# EAGLE schematic SWD (EAGLE 7.4.0)
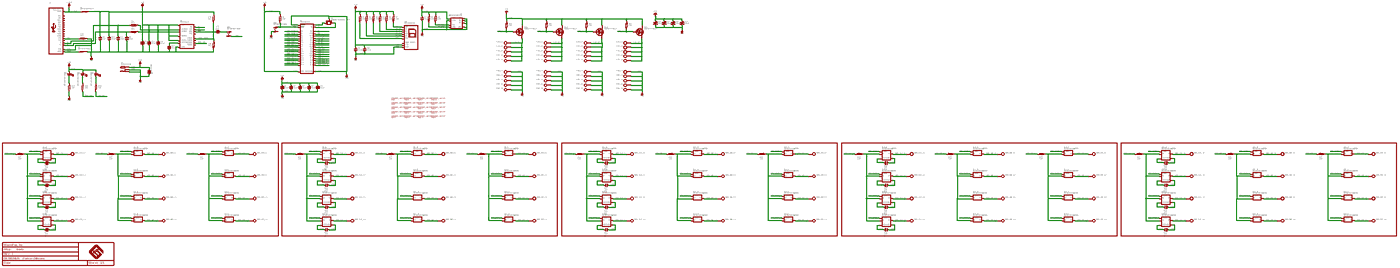
[diagram p0: schematic, sheet 1, overview]
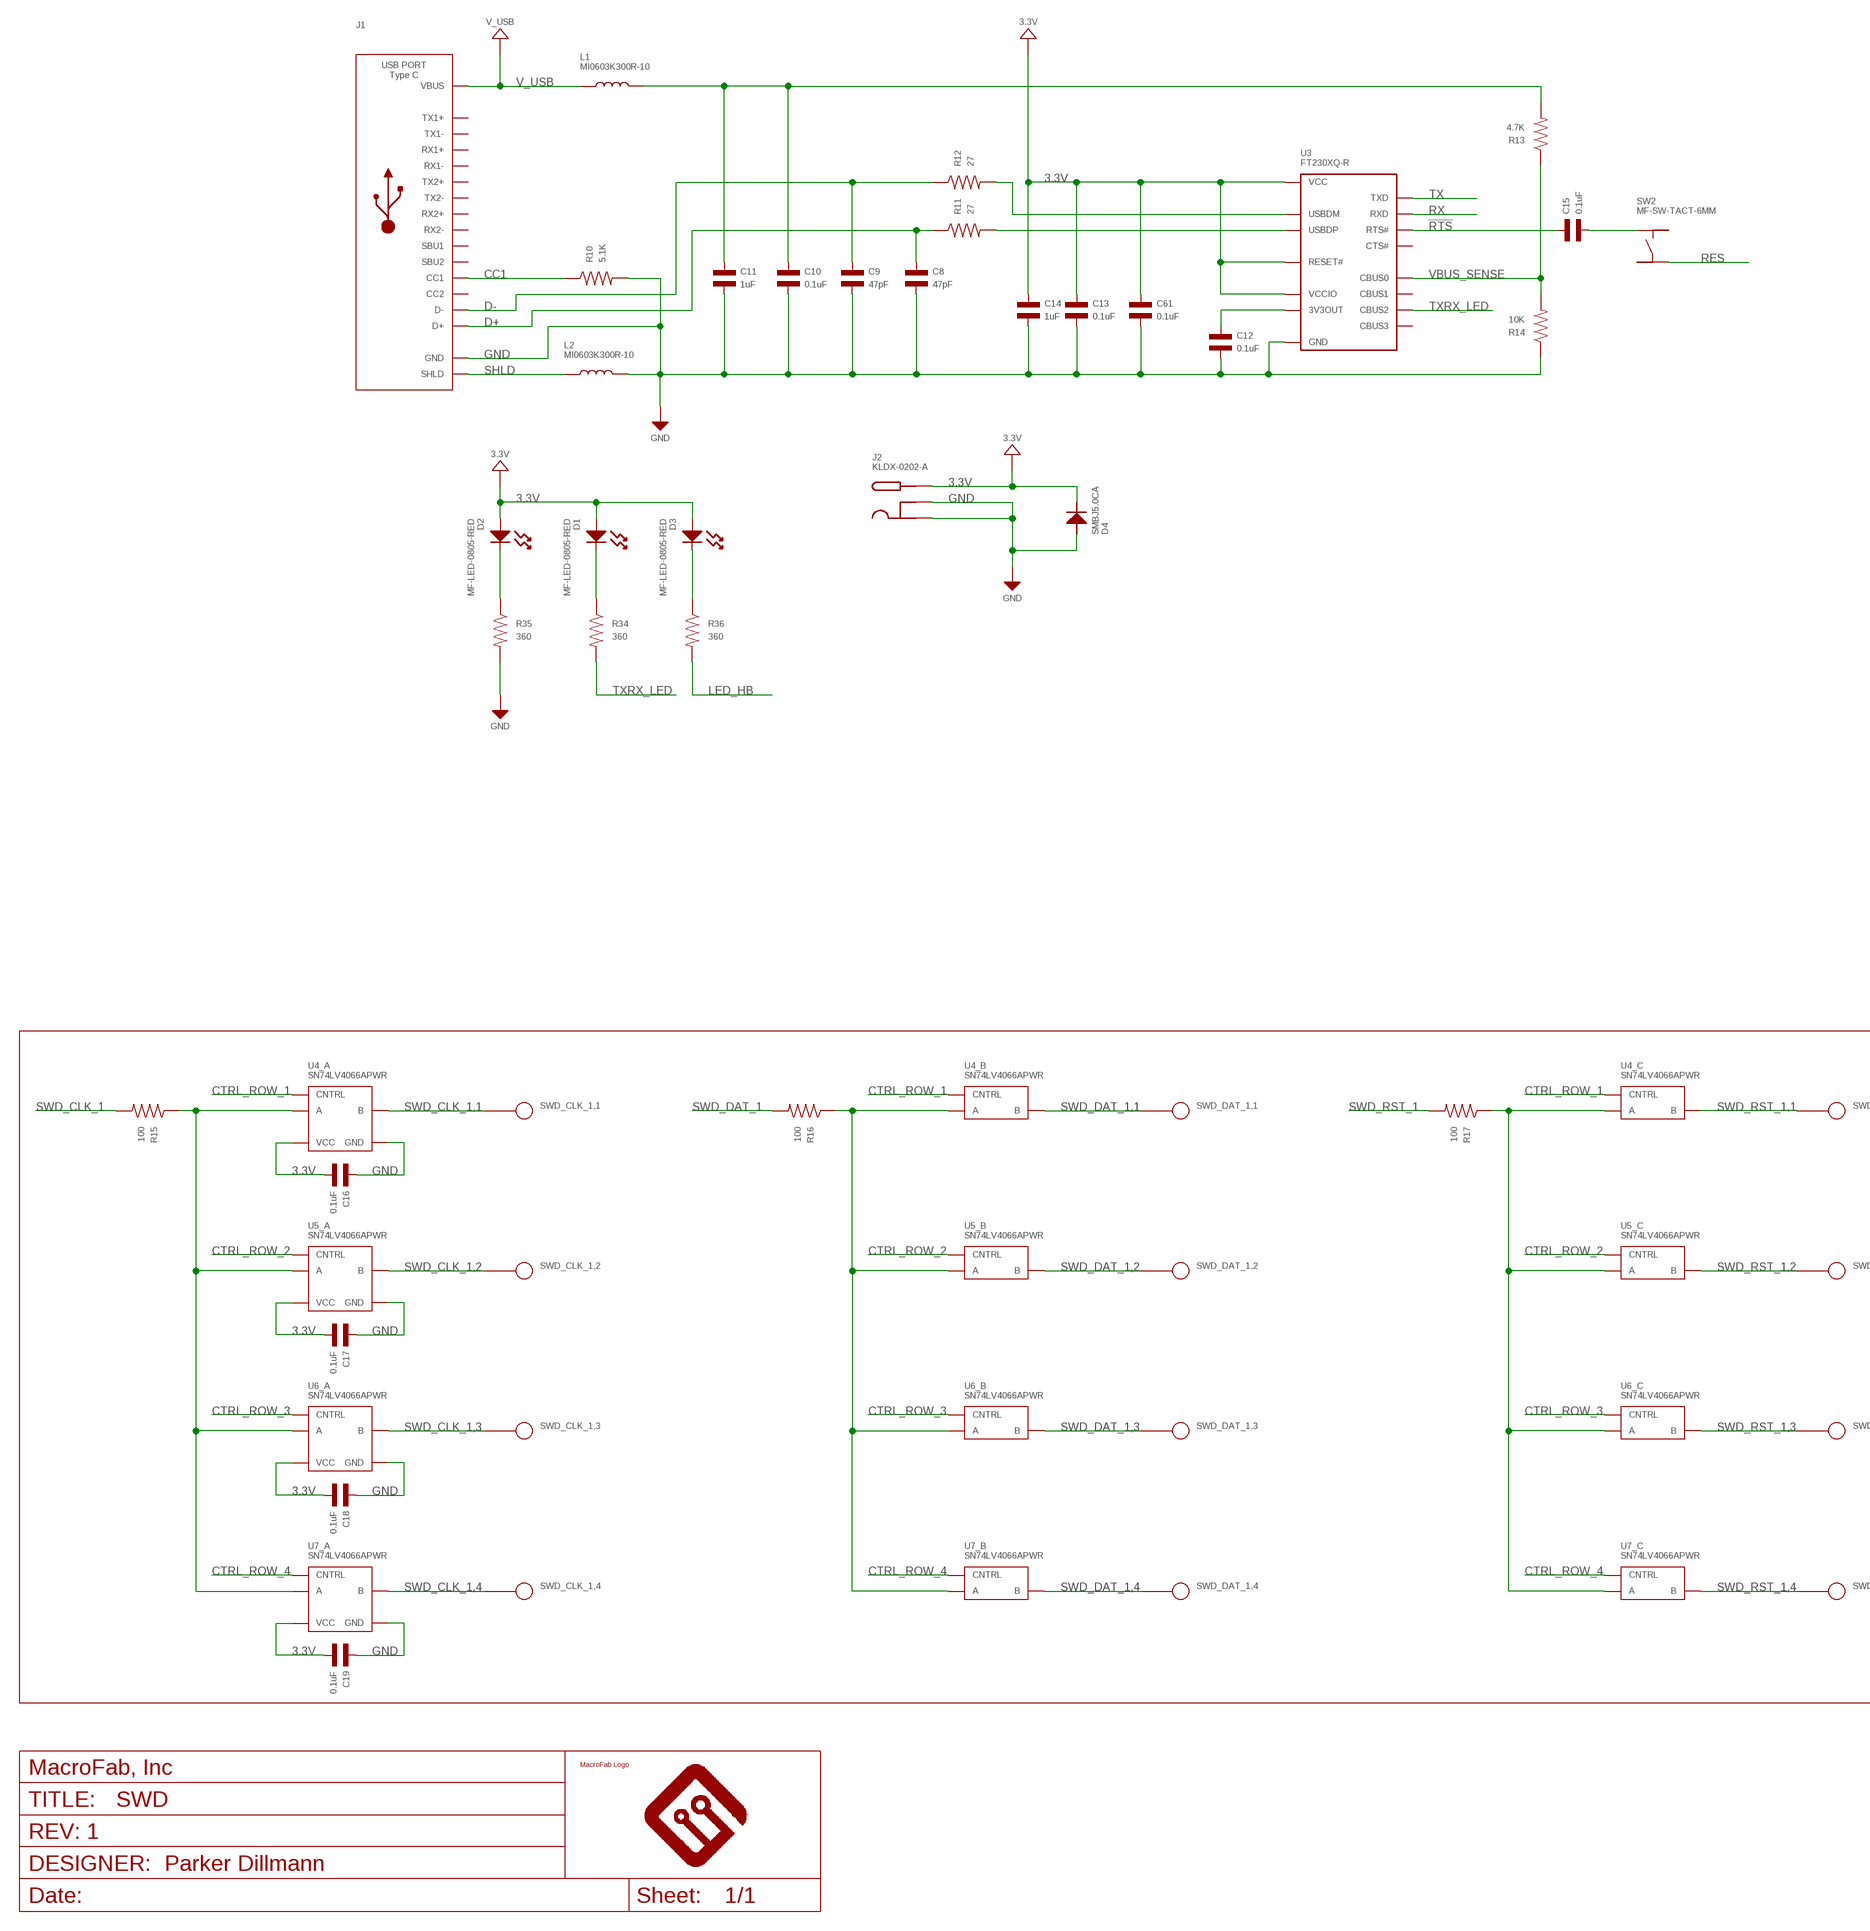
[diagram p1: schematic, sheet 1, part 1 of 8]
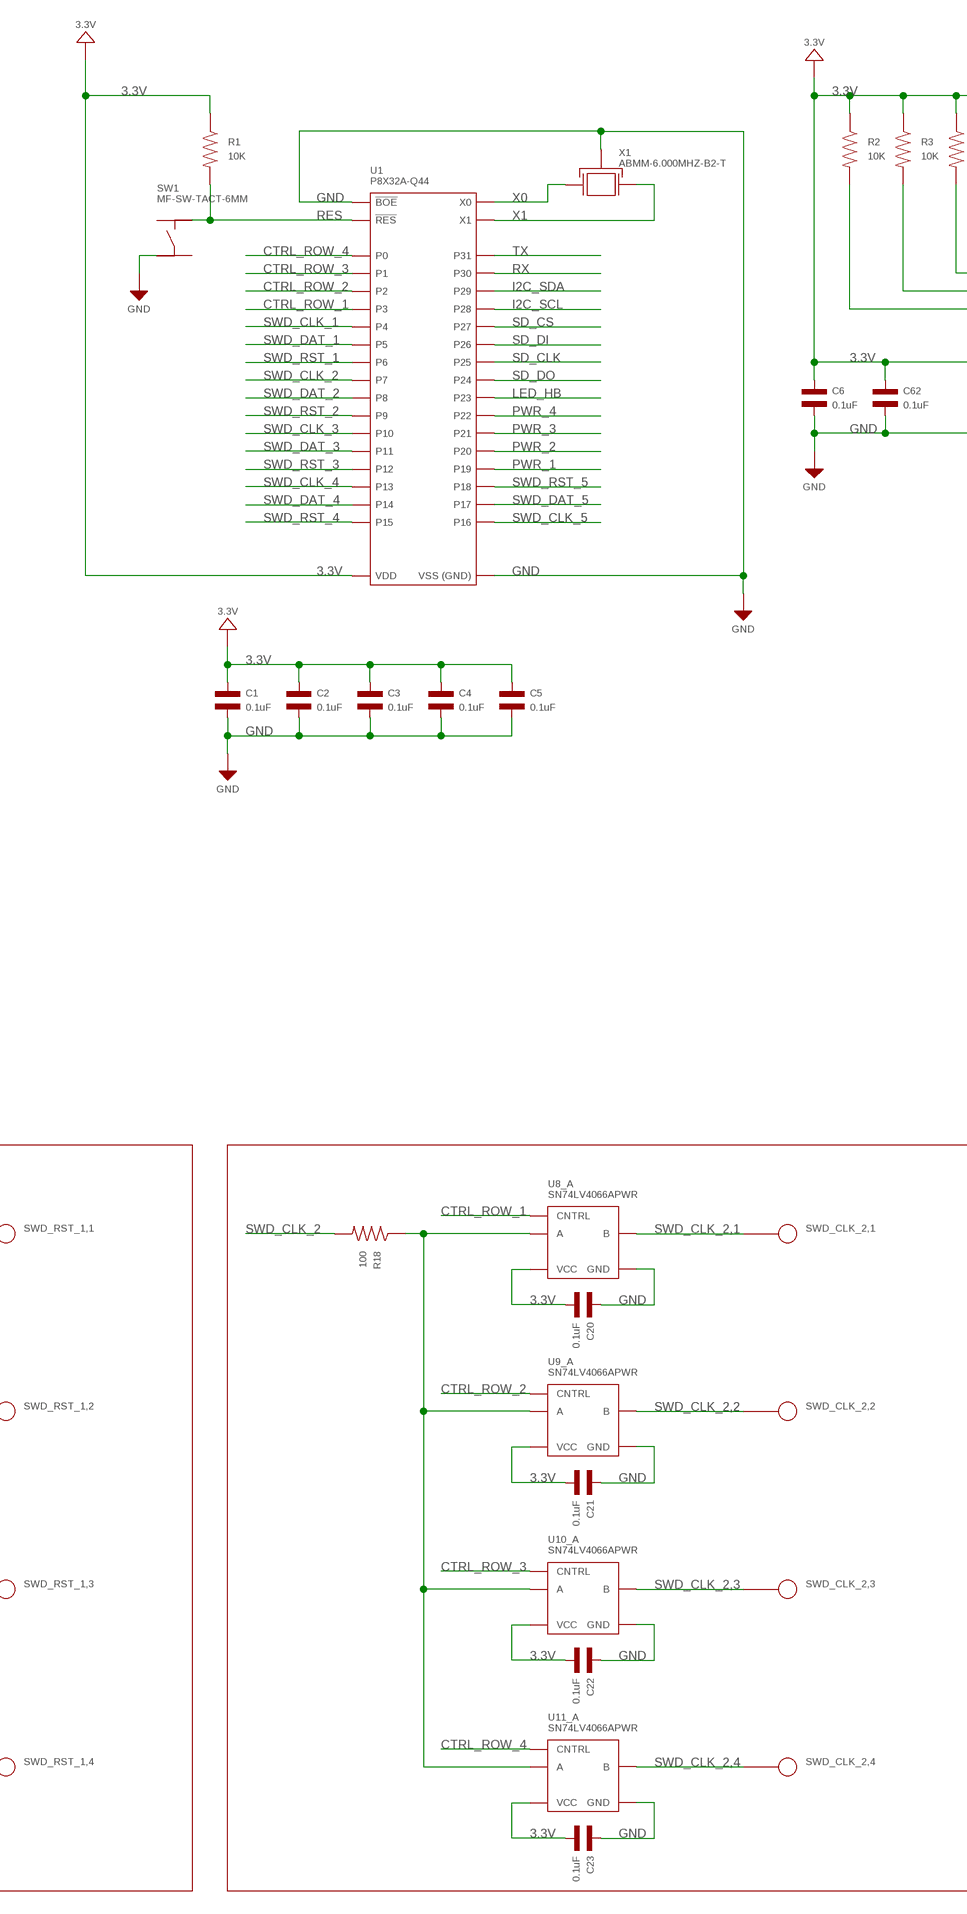
[diagram p2: schematic, sheet 1, part 2 of 8]
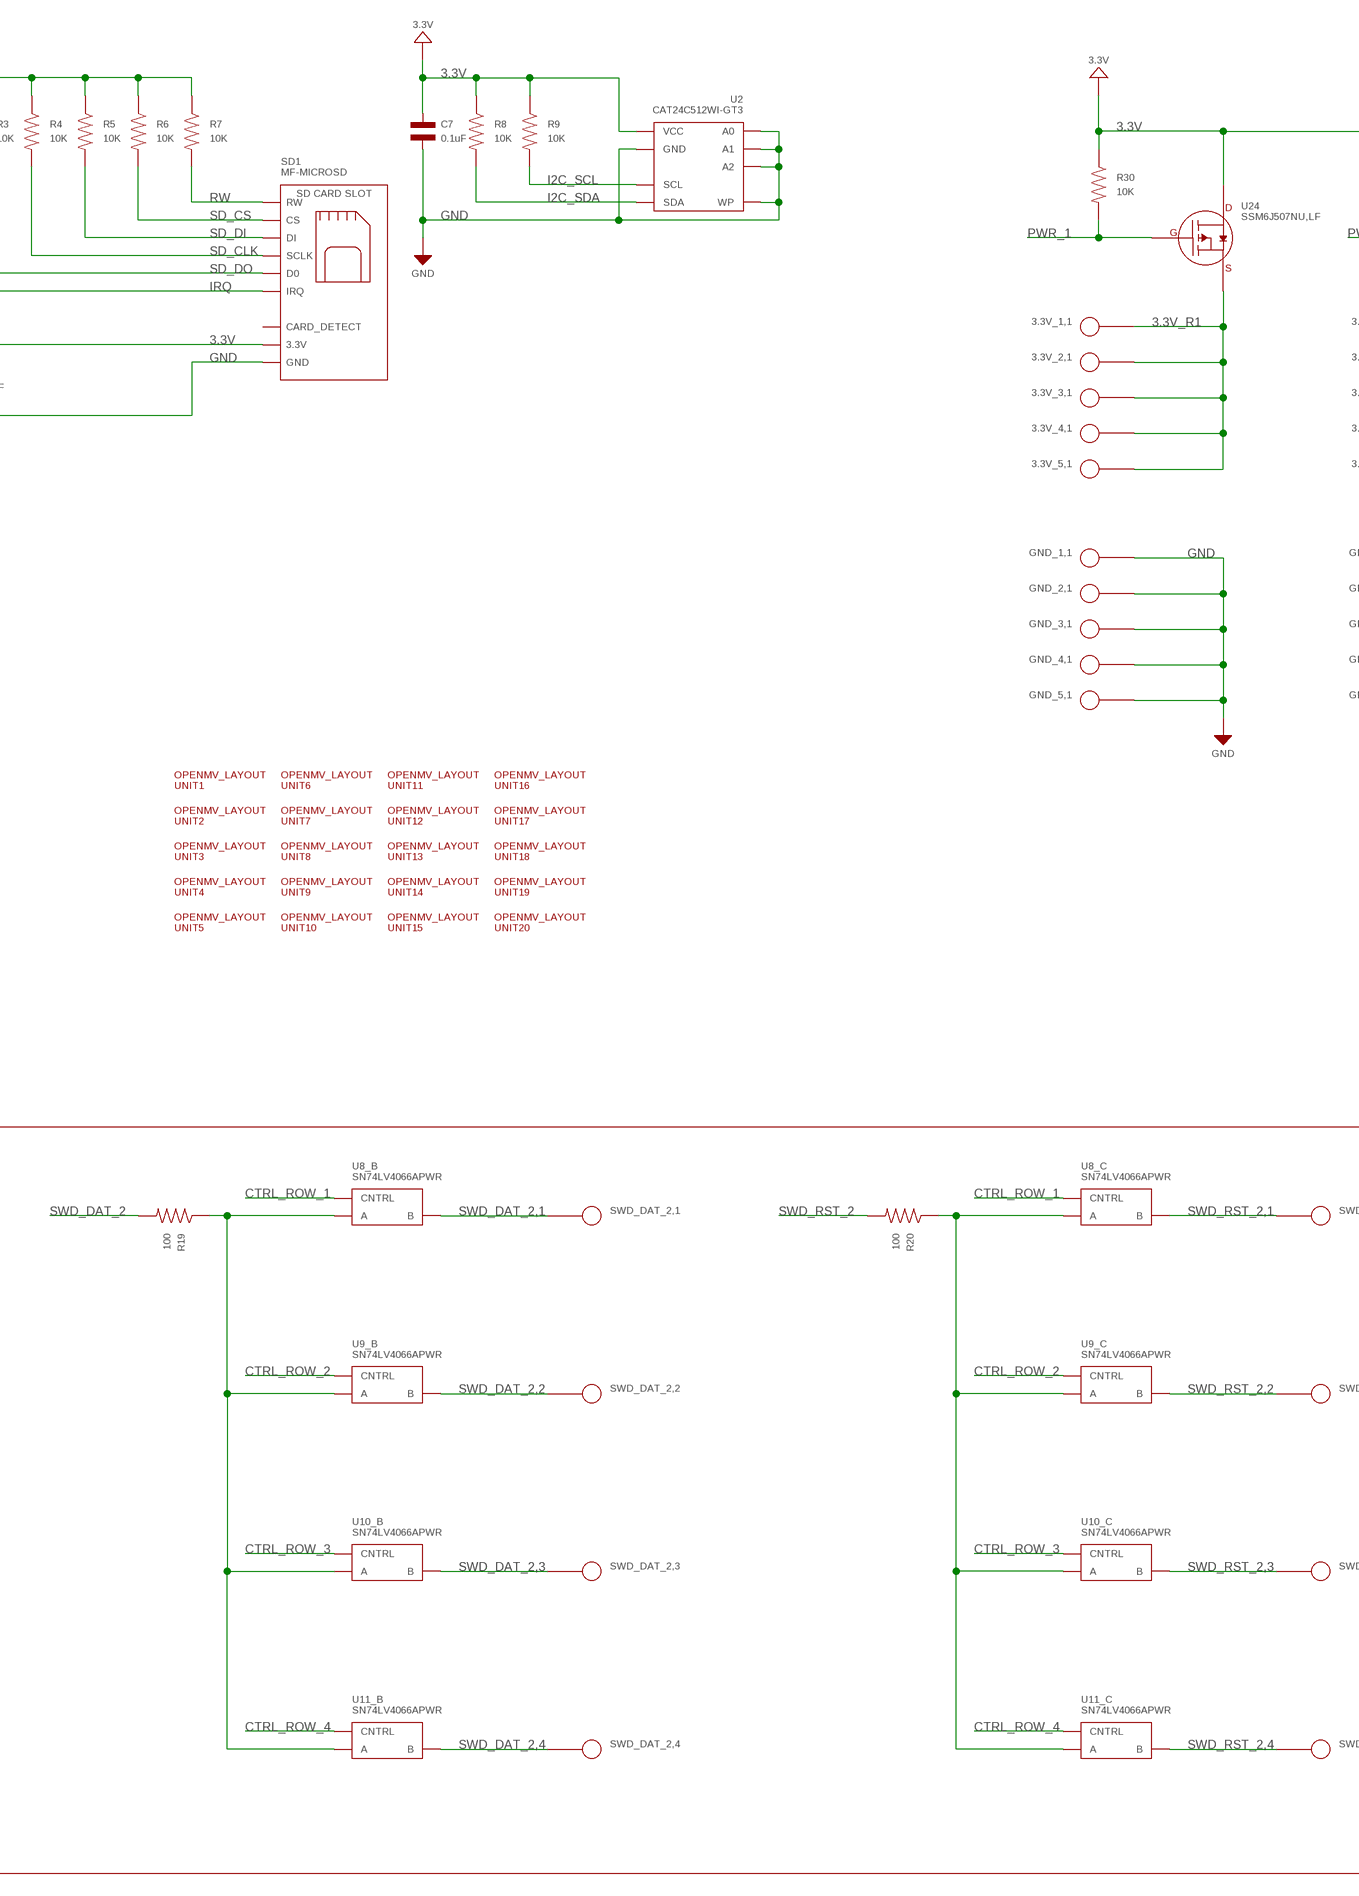
[diagram p3: schematic, sheet 1, part 3 of 8]
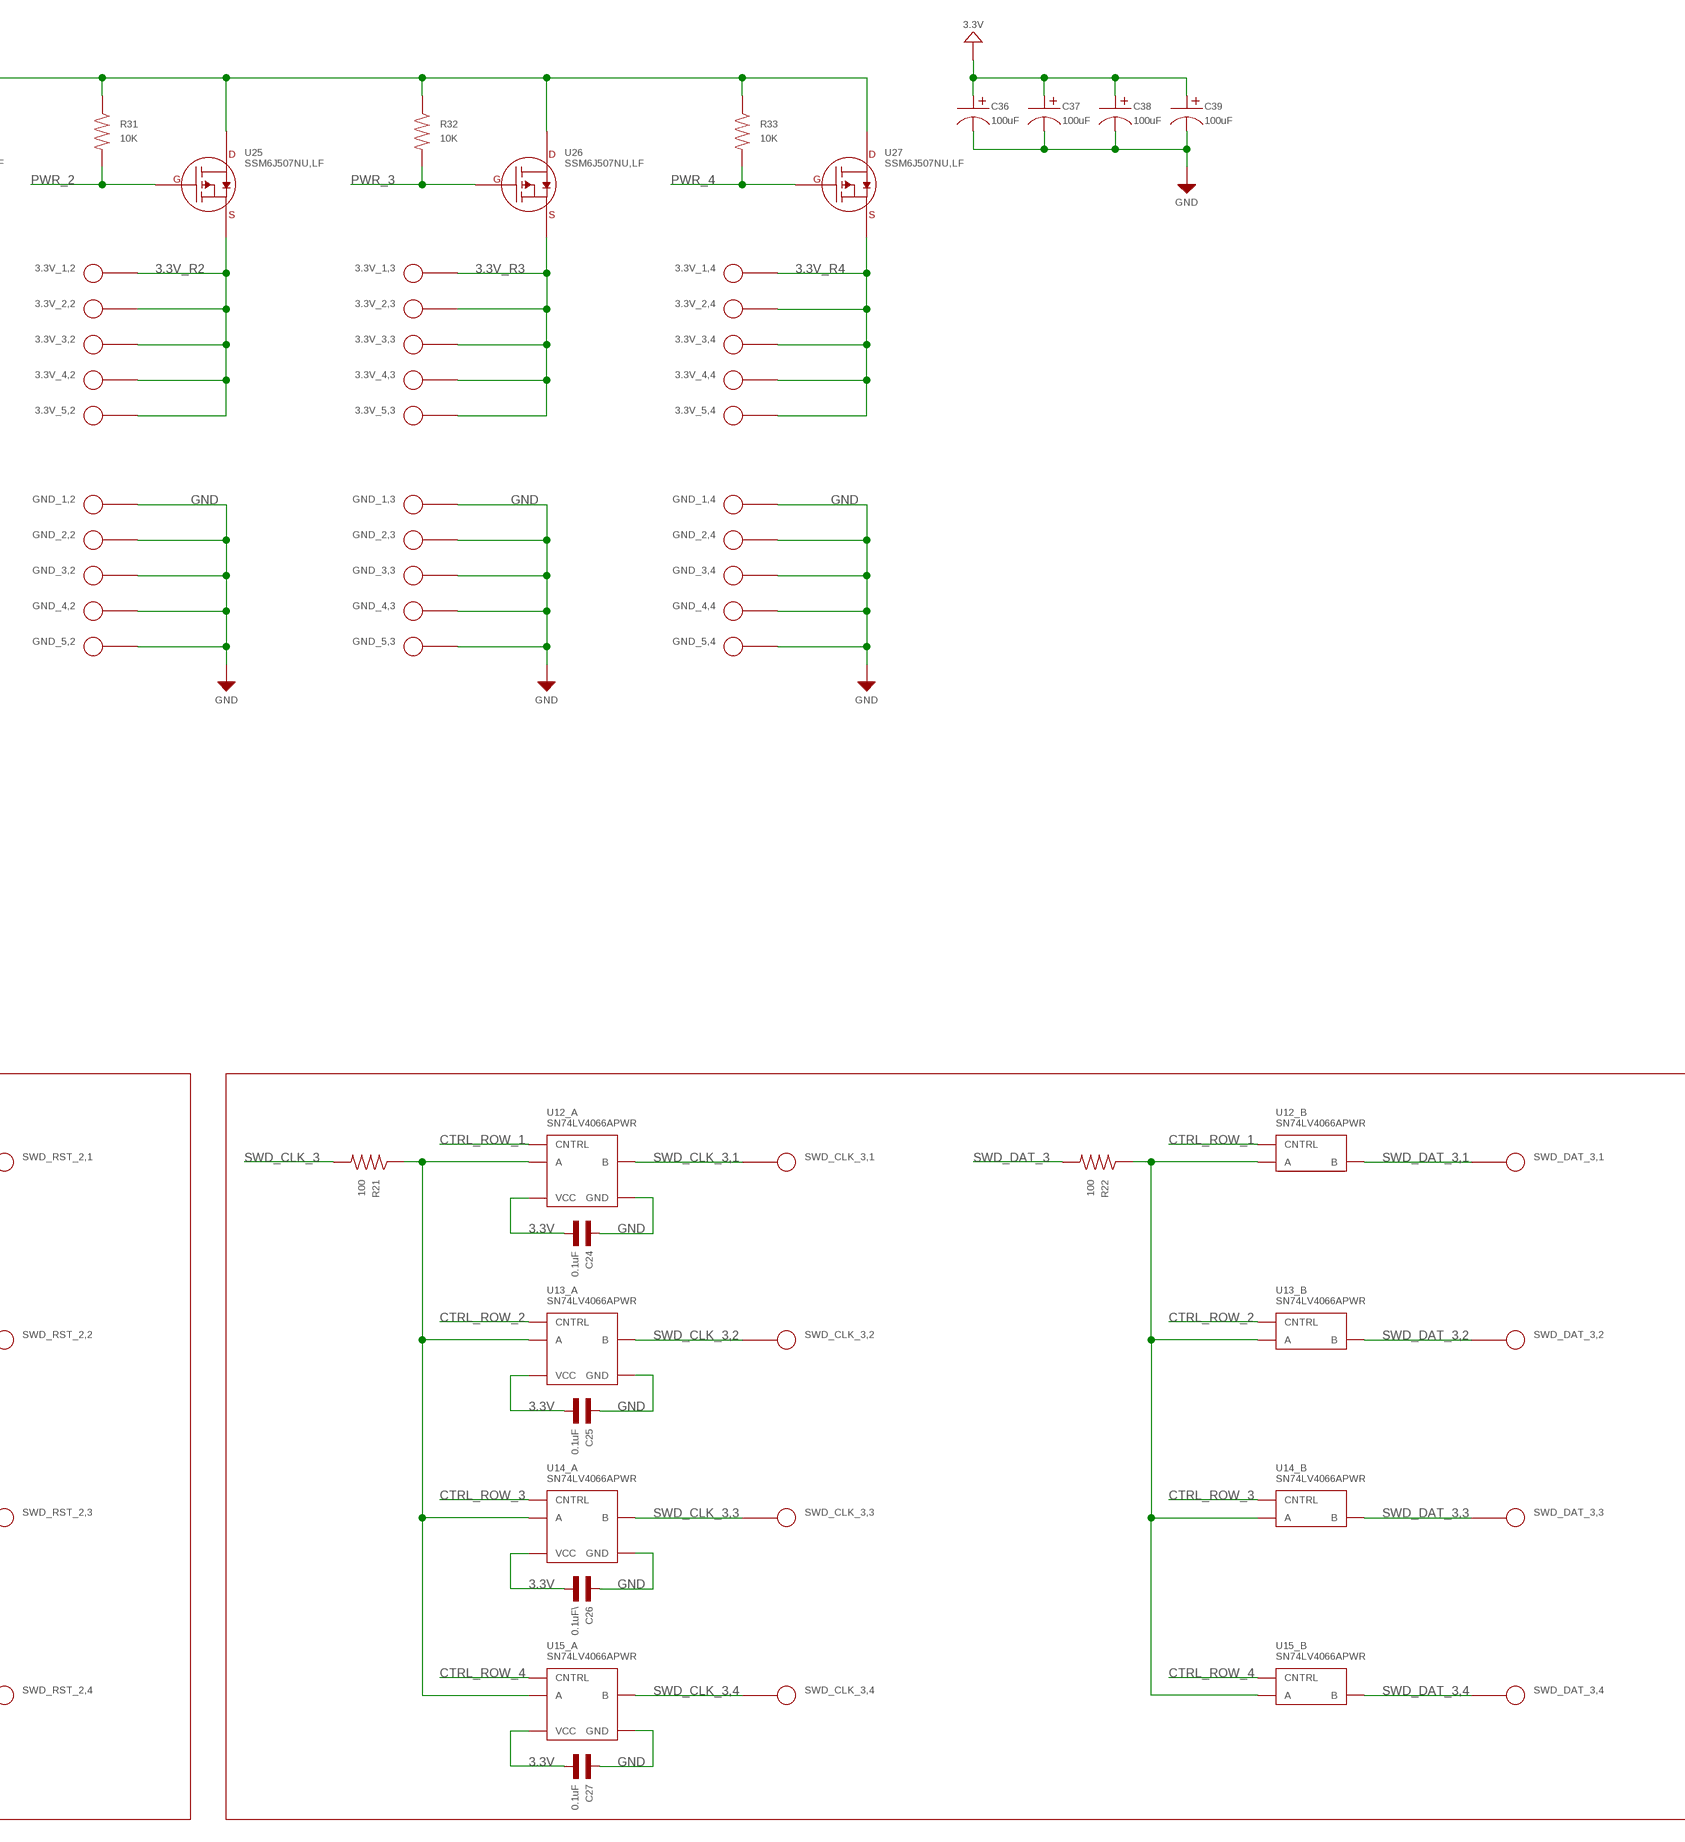
[diagram p4: schematic, sheet 1, part 4 of 8]
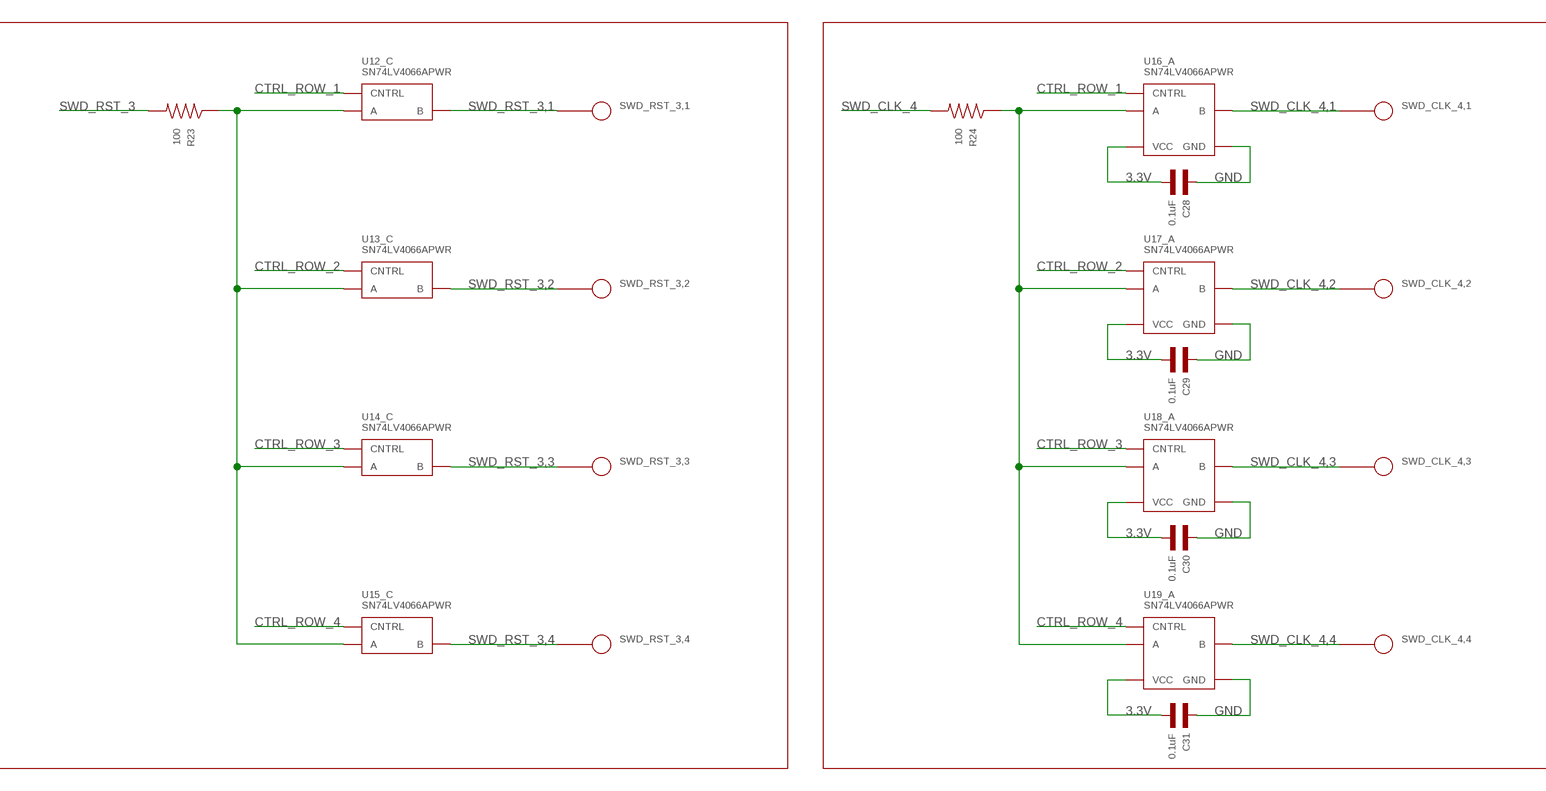
[diagram p5: schematic, sheet 1, part 5 of 8]
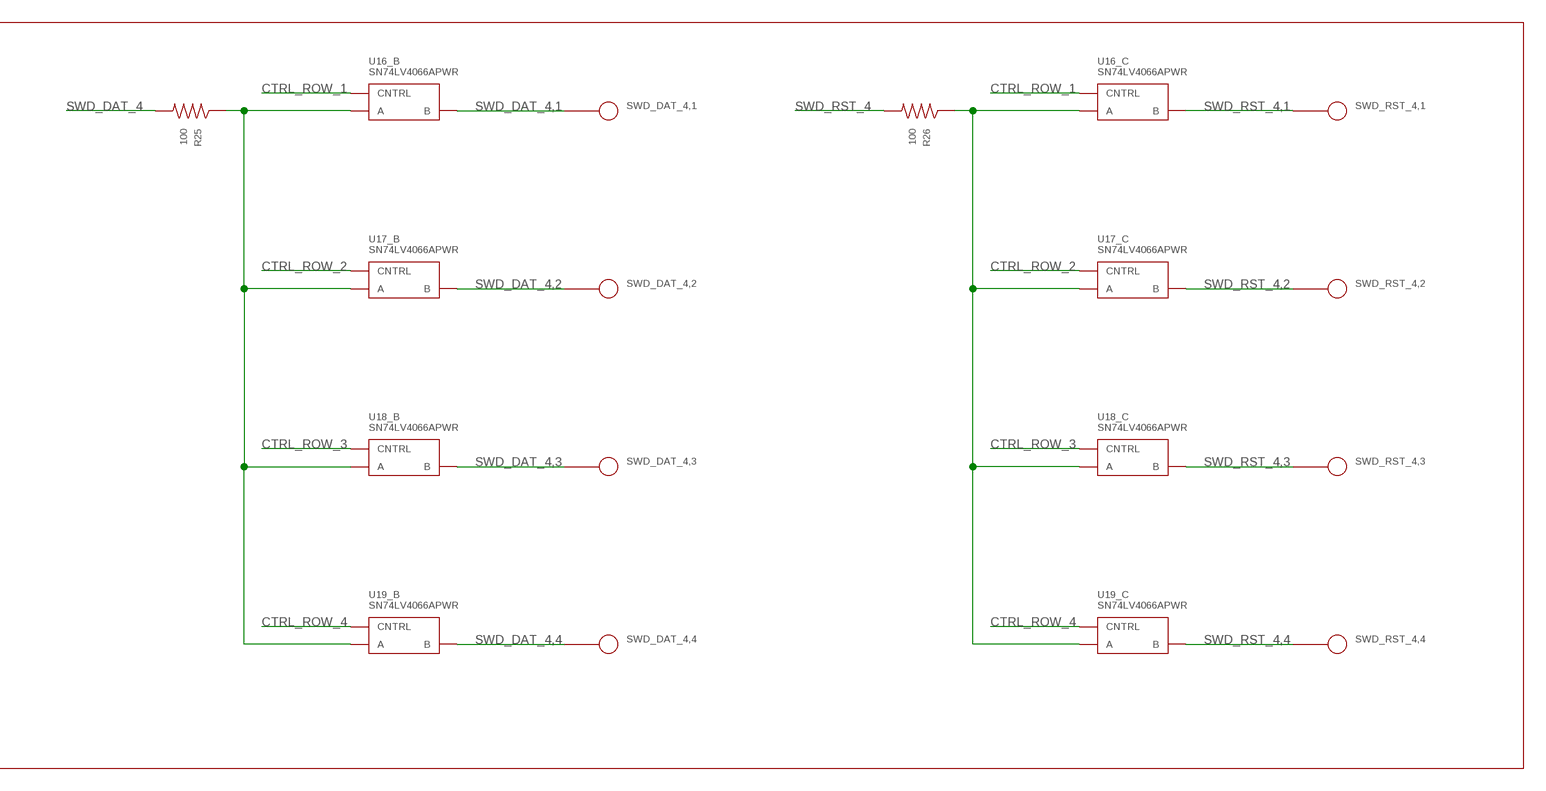
[diagram p6: schematic, sheet 1, part 6 of 8]
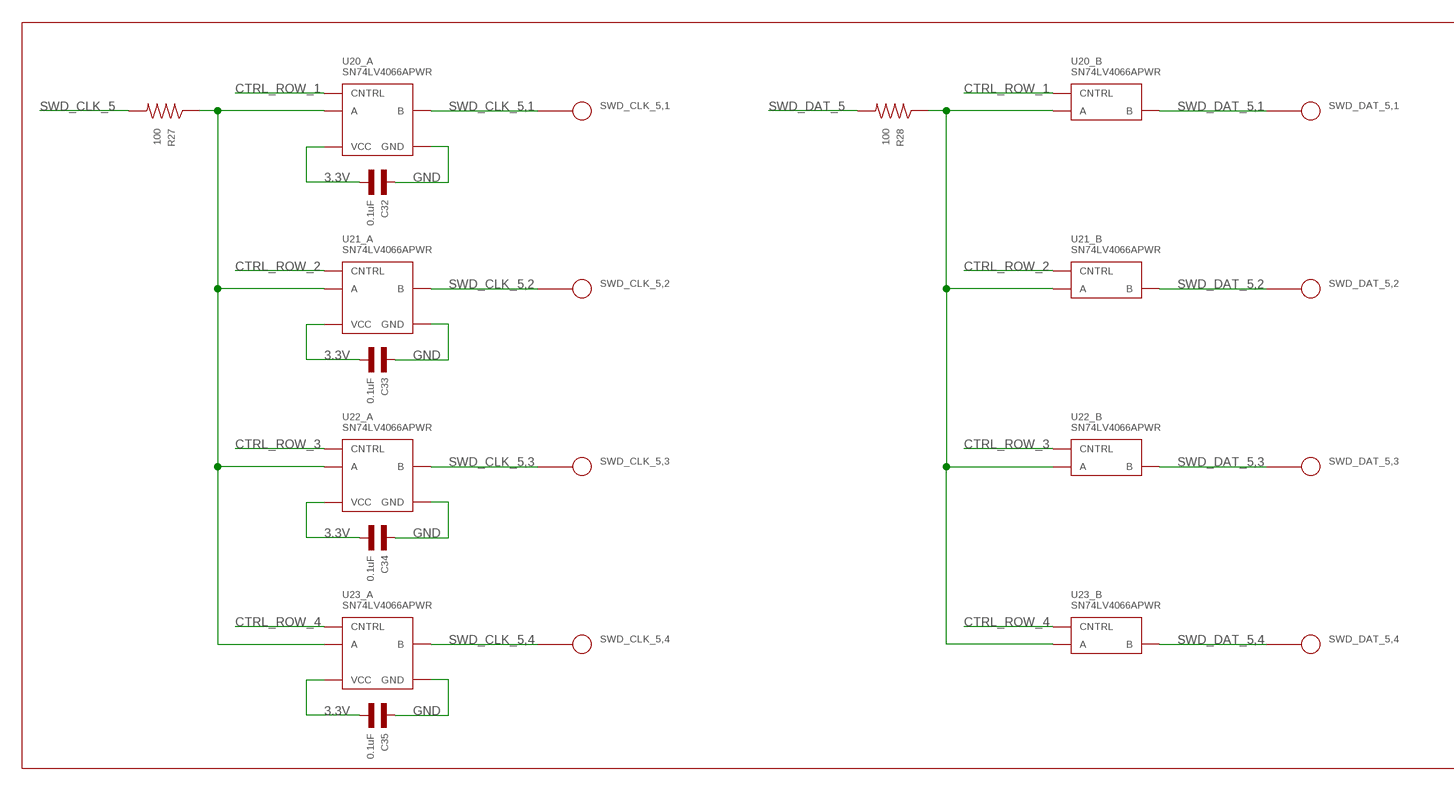
[diagram p7: schematic, sheet 1, part 7 of 8]
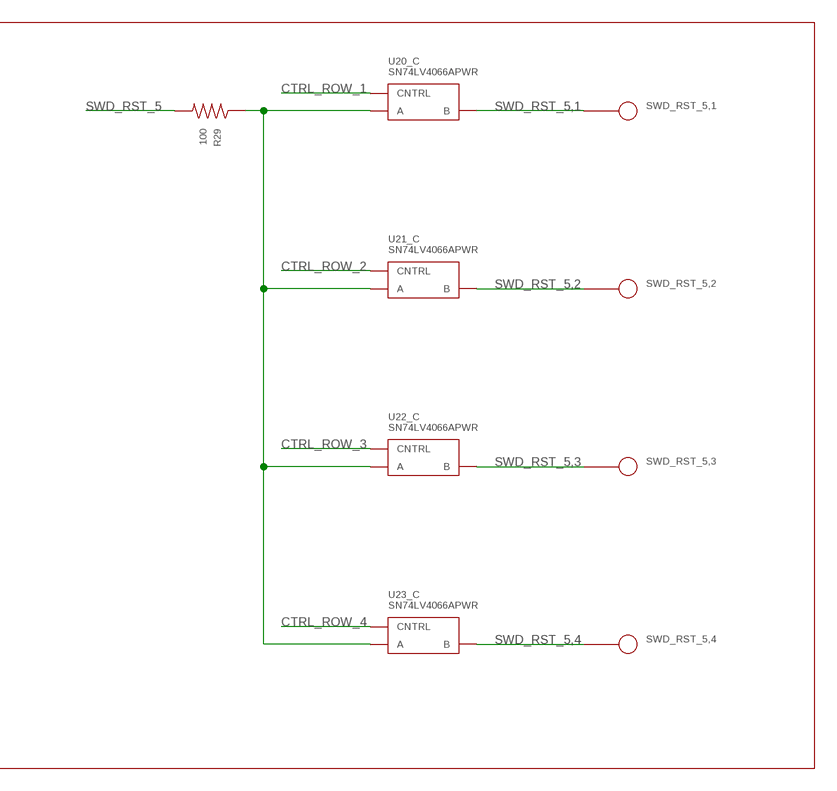
[diagram p8: schematic, sheet 1, part 8 of 8]

## Parts
3.3V_1,1  POGO_PIN_0908-4-15-20-75-14-11-0  [0908-4-15-20-75-14-11-0]
3.3V_1,2  POGO_PIN_0908-4-15-20-75-14-11-0  [0908-4-15-20-75-14-11-0]
3.3V_1,3  POGO_PIN_0908-4-15-20-75-14-11-0  [0908-4-15-20-75-14-11-0]
3.3V_1,4  POGO_PIN_0908-4-15-20-75-14-11-0  [0908-4-15-20-75-14-11-0]
3.3V_2,1  POGO_PIN_0908-4-15-20-75-14-11-0  [0908-4-15-20-75-14-11-0]
3.3V_2,2  POGO_PIN_0908-4-15-20-75-14-11-0  [0908-4-15-20-75-14-11-0]
3.3V_2,3  POGO_PIN_0908-4-15-20-75-14-11-0  [0908-4-15-20-75-14-11-0]
3.3V_2,4  POGO_PIN_0908-4-15-20-75-14-11-0  [0908-4-15-20-75-14-11-0]
3.3V_3,1  POGO_PIN_0908-4-15-20-75-14-11-0  [0908-4-15-20-75-14-11-0]
3.3V_3,2  POGO_PIN_0908-4-15-20-75-14-11-0  [0908-4-15-20-75-14-11-0]
3.3V_3,3  POGO_PIN_0908-4-15-20-75-14-11-0  [0908-4-15-20-75-14-11-0]
3.3V_3,4  POGO_PIN_0908-4-15-20-75-14-11-0  [0908-4-15-20-75-14-11-0]
3.3V_4,1  POGO_PIN_0908-4-15-20-75-14-11-0  [0908-4-15-20-75-14-11-0]
3.3V_4,2  POGO_PIN_0908-4-15-20-75-14-11-0  [0908-4-15-20-75-14-11-0]
3.3V_4,3  POGO_PIN_0908-4-15-20-75-14-11-0  [0908-4-15-20-75-14-11-0]
3.3V_4,4  POGO_PIN_0908-4-15-20-75-14-11-0  [0908-4-15-20-75-14-11-0]
3.3V_5,1  POGO_PIN_0908-4-15-20-75-14-11-0  [0908-4-15-20-75-14-11-0]
3.3V_5,2  POGO_PIN_0908-4-15-20-75-14-11-0  [0908-4-15-20-75-14-11-0]
3.3V_5,3  POGO_PIN_0908-4-15-20-75-14-11-0  [0908-4-15-20-75-14-11-0]
3.3V_5,4  POGO_PIN_0908-4-15-20-75-14-11-0  [0908-4-15-20-75-14-11-0]
C1  0.1uF  CAPACITOR_NP_0603  [C0603]
C2  0.1uF  CAPACITOR_NP_0603  [C0603]
C3  0.1uF  CAPACITOR_NP_0603  [C0603]
C4  0.1uF  CAPACITOR_NP_0603  [C0603]
C5  0.1uF  CAPACITOR_NP_0603  [C0603]
C6  0.1uF  CAPACITOR_NP_0603  [C0603]
C7  0.1uF  CAPACITOR_NP_0603  [C0603]
C8  47pF  CAPACITOR_NP_0603  [C0603]
C9  47pF  CAPACITOR_NP_0603  [C0603]
C10  0.1uF  CAPACITOR_NP_0603  [C0603]
C11  1uF  CAPACITOR_NP_0603  [C0603]
C12  0.1uF  CAPACITOR_NP_0603  [C0603]
C13  0.1uF  CAPACITOR_NP_0603  [C0603]
C14  1uF  CAPACITOR_NP_0603  [C0603]
C15  0.1uF  CAPACITOR_NP_0603  [C0603]
C16  0.1uF  CAPACITOR_NP_0603  [C0603]
C17  0.1uF  CAPACITOR_NP_0603  [C0603]
C18  0.1uF  CAPACITOR_NP_0603  [C0603]
C19  0.1uF  CAPACITOR_NP_0603  [C0603]
C20  0.1uF  CAPACITOR_NP_0603  [C0603]
C21  0.1uF  CAPACITOR_NP_0603  [C0603]
C22  0.1uF  CAPACITOR_NP_0603  [C0603]
C23  0.1uF  CAPACITOR_NP_0603  [C0603]
C24  0.1uF  CAPACITOR_NP_0603  [C0603]
C25  0.1uF  CAPACITOR_NP_0603  [C0603]
C26  0.1uF\  CAPACITOR_NP_0603  [C0603]
C27  0.1uF  CAPACITOR_NP_0603  [C0603]
C28  0.1uF  CAPACITOR_NP_0603  [C0603]
C29  0.1uF  CAPACITOR_NP_0603  [C0603]
C30  0.1uF  CAPACITOR_NP_0603  [C0603]
C31  0.1uF  CAPACITOR_NP_0603  [C0603]
C32  0.1uF  CAPACITOR_NP_0603  [C0603]
C33  0.1uF  CAPACITOR_NP_0603  [C0603]
C34  0.1uF  CAPACITOR_NP_0603  [C0603]
C35  0.1uF  CAPACITOR_NP_0603  [C0603]
C36  100uF  CAPACITOR_P_6.3MM  [CP6.3MM]
C37  100uF  CAPACITOR_P_6.3MM  [CP6.3MM]
C38  100uF  CAPACITOR_P_6.3MM  [CP6.3MM]
C39  100uF  CAPACITOR_P_6.3MM  [CP6.3MM]
C61  0.1uF  CAPACITOR_NP_0603  [C0603]
C62  0.1uF  CAPACITOR_NP_0603  [C0603]
D1  MF-LED-0805-RED  LED_SINGLE-0805-RED  [LED0805]
D2  MF-LED-0805-RED  LED_SINGLE-0805-RED  [LED0805]
D3  MF-LED-0805-RED  LED_SINGLE-0805-RED  [LED0805]
D4  SMBJ5.0CA  DIODE_SMBJ  [SMBJ]
FRAME1  MF_FRAMEDEFAULT  [MF_FRAME_DEFAULT]
GND_1,1  POGO_PIN_0908-4-15-20-75-14-11-0  [0908-4-15-20-75-14-11-0]
GND_1,2  POGO_PIN_0908-4-15-20-75-14-11-0  [0908-4-15-20-75-14-11-0]
GND_1,3  POGO_PIN_0908-4-15-20-75-14-11-0  [0908-4-15-20-75-14-11-0]
GND_1,4  POGO_PIN_0908-4-15-20-75-14-11-0  [0908-4-15-20-75-14-11-0]
GND_2,1  POGO_PIN_0908-4-15-20-75-14-11-0  [0908-4-15-20-75-14-11-0]
GND_2,2  POGO_PIN_0908-4-15-20-75-14-11-0  [0908-4-15-20-75-14-11-0]
GND_2,3  POGO_PIN_0908-4-15-20-75-14-11-0  [0908-4-15-20-75-14-11-0]
GND_2,4  POGO_PIN_0908-4-15-20-75-14-11-0  [0908-4-15-20-75-14-11-0]
GND_3,1  POGO_PIN_0908-4-15-20-75-14-11-0  [0908-4-15-20-75-14-11-0]
GND_3,2  POGO_PIN_0908-4-15-20-75-14-11-0  [0908-4-15-20-75-14-11-0]
GND_3,3  POGO_PIN_0908-4-15-20-75-14-11-0  [0908-4-15-20-75-14-11-0]
GND_3,4  POGO_PIN_0908-4-15-20-75-14-11-0  [0908-4-15-20-75-14-11-0]
GND_4,1  POGO_PIN_0908-4-15-20-75-14-11-0  [0908-4-15-20-75-14-11-0]
GND_4,2  POGO_PIN_0908-4-15-20-75-14-11-0  [0908-4-15-20-75-14-11-0]
GND_4,3  POGO_PIN_0908-4-15-20-75-14-11-0  [0908-4-15-20-75-14-11-0]
GND_4,4  POGO_PIN_0908-4-15-20-75-14-11-0  [0908-4-15-20-75-14-11-0]
GND_5,1  POGO_PIN_0908-4-15-20-75-14-11-0  [0908-4-15-20-75-14-11-0]
GND_5,2  POGO_PIN_0908-4-15-20-75-14-11-0  [0908-4-15-20-75-14-11-0]
GND_5,3  POGO_PIN_0908-4-15-20-75-14-11-0  [0908-4-15-20-75-14-11-0]
GND_5,4  POGO_PIN_0908-4-15-20-75-14-11-0  [0908-4-15-20-75-14-11-0]
J1  USB_TYPE-C_105450-0101  [105450-0101]
J2  KLDX-0202-A  DC_PWR_JACK_2.0MM_RIGHT  [DC_PWR_JACK]
L1  MI0603K300R-10  INDUCTOR_0603  [L0603]
L2  MI0603K300R-10  INDUCTOR_0603  [L0603]
R1  10K  RESISTOR_0603  [R0603]
R2  10K  RESISTOR_0603  [R0603]
R3  10K  RESISTOR_0603  [R0603]
R4  10K  RESISTOR_0603  [R0603]
R5  10K  RESISTOR_0603  [R0603]
R6  10K  RESISTOR_0603  [R0603]
R7  10K  RESISTOR_0603  [R0603]
R8  10K  RESISTOR_0603  [R0603]
R9  10K  RESISTOR_0603  [R0603]
R10  5.1K  RESISTOR_0603  [R0603]
R11  27  RESISTOR_0603  [R0603]
R12  27  RESISTOR_0603  [R0603]
R13  4.7K  RESISTOR_0603  [R0603]
R14  10K  RESISTOR_0603  [R0603]
R15  100  RESISTOR_0603  [R0603]
R16  100  RESISTOR_0603  [R0603]
R17  100  RESISTOR_0603  [R0603]
R18  100  RESISTOR_0603  [R0603]
R19  100  RESISTOR_0603  [R0603]
R20  100  RESISTOR_0603  [R0603]
R21  100  RESISTOR_0603  [R0603]
R22  100  RESISTOR_0603  [R0603]
R23  100  RESISTOR_0603  [R0603]
R24  100  RESISTOR_0603  [R0603]
R25  100  RESISTOR_0603  [R0603]
R26  100  RESISTOR_0603  [R0603]
R27  100  RESISTOR_0603  [R0603]
R28  100  RESISTOR_0603  [R0603]
R29  100  RESISTOR_0603  [R0603]
R30  10K  RESISTOR_0603  [R0603]
R31  10K  RESISTOR_0603  [R0603]
R32  10K  RESISTOR_0603  [R0603]
R33  10K  RESISTOR_0603  [R0603]
R34  360  RESISTOR_0603  [R0603]
R35  360  RESISTOR_0603  [R0603]
R36  360  RESISTOR_0603  [R0603]
SD1  MF-MICROSD  SD_CARD_SLOT_MICRO_RIGHT  [MF-MICROSD]
SW1  MF-SW-TACT-6MM  TACT_6MM  [TACT6MM]
SW2  MF-SW-TACT-6MM  TACT_6MM  [TACT6MM]
SWD_CLK_1,1  POGO_PIN_0908-4-15-20-75-14-11-0  [0908-4-15-20-75-14-11-0]
SWD_CLK_1,2  POGO_PIN_0908-4-15-20-75-14-11-0  [0908-4-15-20-75-14-11-0]
SWD_CLK_1,3  POGO_PIN_0908-4-15-20-75-14-11-0  [0908-4-15-20-75-14-11-0]
SWD_CLK_1,4  POGO_PIN_0908-4-15-20-75-14-11-0  [0908-4-15-20-75-14-11-0]
SWD_CLK_2,1  POGO_PIN_0908-4-15-20-75-14-11-0  [0908-4-15-20-75-14-11-0]
SWD_CLK_2,2  POGO_PIN_0908-4-15-20-75-14-11-0  [0908-4-15-20-75-14-11-0]
SWD_CLK_2,3  POGO_PIN_0908-4-15-20-75-14-11-0  [0908-4-15-20-75-14-11-0]
SWD_CLK_2,4  POGO_PIN_0908-4-15-20-75-14-11-0  [0908-4-15-20-75-14-11-0]
SWD_CLK_3,1  POGO_PIN_0908-4-15-20-75-14-11-0  [0908-4-15-20-75-14-11-0]
SWD_CLK_3,2  POGO_PIN_0908-4-15-20-75-14-11-0  [0908-4-15-20-75-14-11-0]
SWD_CLK_3,3  POGO_PIN_0908-4-15-20-75-14-11-0  [0908-4-15-20-75-14-11-0]
SWD_CLK_3,4  POGO_PIN_0908-4-15-20-75-14-11-0  [0908-4-15-20-75-14-11-0]
SWD_CLK_4,1  POGO_PIN_0908-4-15-20-75-14-11-0  [0908-4-15-20-75-14-11-0]
SWD_CLK_4,2  POGO_PIN_0908-4-15-20-75-14-11-0  [0908-4-15-20-75-14-11-0]
SWD_CLK_4,3  POGO_PIN_0908-4-15-20-75-14-11-0  [0908-4-15-20-75-14-11-0]
SWD_CLK_4,4  POGO_PIN_0908-4-15-20-75-14-11-0  [0908-4-15-20-75-14-11-0]
SWD_CLK_5,1  POGO_PIN_0908-4-15-20-75-14-11-0  [0908-4-15-20-75-14-11-0]
SWD_CLK_5,2  POGO_PIN_0908-4-15-20-75-14-11-0  [0908-4-15-20-75-14-11-0]
SWD_CLK_5,3  POGO_PIN_0908-4-15-20-75-14-11-0  [0908-4-15-20-75-14-11-0]
SWD_CLK_5,4  POGO_PIN_0908-4-15-20-75-14-11-0  [0908-4-15-20-75-14-11-0]
SWD_DAT_1,1  POGO_PIN_0908-4-15-20-75-14-11-0  [0908-4-15-20-75-14-11-0]
SWD_DAT_1,2  POGO_PIN_0908-4-15-20-75-14-11-0  [0908-4-15-20-75-14-11-0]
SWD_DAT_1,3  POGO_PIN_0908-4-15-20-75-14-11-0  [0908-4-15-20-75-14-11-0]
SWD_DAT_1,4  POGO_PIN_0908-4-15-20-75-14-11-0  [0908-4-15-20-75-14-11-0]
SWD_DAT_2,1  POGO_PIN_0908-4-15-20-75-14-11-0  [0908-4-15-20-75-14-11-0]
SWD_DAT_2,2  POGO_PIN_0908-4-15-20-75-14-11-0  [0908-4-15-20-75-14-11-0]
SWD_DAT_2,3  POGO_PIN_0908-4-15-20-75-14-11-0  [0908-4-15-20-75-14-11-0]
SWD_DAT_2,4  POGO_PIN_0908-4-15-20-75-14-11-0  [0908-4-15-20-75-14-11-0]
SWD_DAT_3,1  POGO_PIN_0908-4-15-20-75-14-11-0  [0908-4-15-20-75-14-11-0]
SWD_DAT_3,2  POGO_PIN_0908-4-15-20-75-14-11-0  [0908-4-15-20-75-14-11-0]
SWD_DAT_3,3  POGO_PIN_0908-4-15-20-75-14-11-0  [0908-4-15-20-75-14-11-0]
SWD_DAT_3,4  POGO_PIN_0908-4-15-20-75-14-11-0  [0908-4-15-20-75-14-11-0]
SWD_DAT_4,1  POGO_PIN_0908-4-15-20-75-14-11-0  [0908-4-15-20-75-14-11-0]
SWD_DAT_4,2  POGO_PIN_0908-4-15-20-75-14-11-0  [0908-4-15-20-75-14-11-0]
SWD_DAT_4,3  POGO_PIN_0908-4-15-20-75-14-11-0  [0908-4-15-20-75-14-11-0]
SWD_DAT_4,4  POGO_PIN_0908-4-15-20-75-14-11-0  [0908-4-15-20-75-14-11-0]
SWD_DAT_5,1  POGO_PIN_0908-4-15-20-75-14-11-0  [0908-4-15-20-75-14-11-0]
SWD_DAT_5,2  POGO_PIN_0908-4-15-20-75-14-11-0  [0908-4-15-20-75-14-11-0]
SWD_DAT_5,3  POGO_PIN_0908-4-15-20-75-14-11-0  [0908-4-15-20-75-14-11-0]
SWD_DAT_5,4  POGO_PIN_0908-4-15-20-75-14-11-0  [0908-4-15-20-75-14-11-0]
SWD_RST_1,1  POGO_PIN_0908-4-15-20-75-14-11-0  [0908-4-15-20-75-14-11-0]
SWD_RST_1,2  POGO_PIN_0908-4-15-20-75-14-11-0  [0908-4-15-20-75-14-11-0]
SWD_RST_1,3  POGO_PIN_0908-4-15-20-75-14-11-0  [0908-4-15-20-75-14-11-0]
SWD_RST_1,4  POGO_PIN_0908-4-15-20-75-14-11-0  [0908-4-15-20-75-14-11-0]
SWD_RST_2,1  POGO_PIN_0908-4-15-20-75-14-11-0  [0908-4-15-20-75-14-11-0]
SWD_RST_2,2  POGO_PIN_0908-4-15-20-75-14-11-0  [0908-4-15-20-75-14-11-0]
SWD_RST_2,3  POGO_PIN_0908-4-15-20-75-14-11-0  [0908-4-15-20-75-14-11-0]
SWD_RST_2,4  POGO_PIN_0908-4-15-20-75-14-11-0  [0908-4-15-20-75-14-11-0]
SWD_RST_3,1  POGO_PIN_0908-4-15-20-75-14-11-0  [0908-4-15-20-75-14-11-0]
SWD_RST_3,2  POGO_PIN_0908-4-15-20-75-14-11-0  [0908-4-15-20-75-14-11-0]
SWD_RST_3,3  POGO_PIN_0908-4-15-20-75-14-11-0  [0908-4-15-20-75-14-11-0]
SWD_RST_3,4  POGO_PIN_0908-4-15-20-75-14-11-0  [0908-4-15-20-75-14-11-0]
SWD_RST_4,1  POGO_PIN_0908-4-15-20-75-14-11-0  [0908-4-15-20-75-14-11-0]
SWD_RST_4,2  POGO_PIN_0908-4-15-20-75-14-11-0  [0908-4-15-20-75-14-11-0]
SWD_RST_4,3  POGO_PIN_0908-4-15-20-75-14-11-0  [0908-4-15-20-75-14-11-0]
SWD_RST_4,4  POGO_PIN_0908-4-15-20-75-14-11-0  [0908-4-15-20-75-14-11-0]
SWD_RST_5,1  POGO_PIN_0908-4-15-20-75-14-11-0  [0908-4-15-20-75-14-11-0]
SWD_RST_5,2  POGO_PIN_0908-4-15-20-75-14-11-0  [0908-4-15-20-75-14-11-0]
SWD_RST_5,3  POGO_PIN_0908-4-15-20-75-14-11-0  [0908-4-15-20-75-14-11-0]
SWD_RST_5,4  POGO_PIN_0908-4-15-20-75-14-11-0  [0908-4-15-20-75-14-11-0]
U1  P8X32A-Q44  [LQFP44]
U2  CAT24C512WI-GT3  EEPROM_I2CSOIC-8_W  [SOIC-8_W]
U3  FT230XQ-R  FT230XQ  [FT230X_QFN-16]
U4  SN74LV4066APWR  [SN74LV4066A_TSSOP-14]
U5  SN74LV4066APWR  [SN74LV4066A_TSSOP-14]
U6  SN74LV4066APWR  [SN74LV4066A_TSSOP-14]
U7  SN74LV4066APWR  [SN74LV4066A_TSSOP-14]
U8  SN74LV4066APWR  [SN74LV4066A_TSSOP-14]
U9  SN74LV4066APWR  [SN74LV4066A_TSSOP-14]
U10  SN74LV4066APWR  [SN74LV4066A_TSSOP-14]
U11  SN74LV4066APWR  [SN74LV4066A_TSSOP-14]
U12  SN74LV4066APWR  [SN74LV4066A_TSSOP-14]
U13  SN74LV4066APWR  [SN74LV4066A_TSSOP-14]
U14  SN74LV4066APWR  [SN74LV4066A_TSSOP-14]
U15  SN74LV4066APWR  [SN74LV4066A_TSSOP-14]
U16  SN74LV4066APWR  [SN74LV4066A_TSSOP-14]
U17  SN74LV4066APWR  [SN74LV4066A_TSSOP-14]
U18  SN74LV4066APWR  [SN74LV4066A_TSSOP-14]
U19  SN74LV4066APWR  [SN74LV4066A_TSSOP-14]
U20  SN74LV4066APWR  [SN74LV4066A_TSSOP-14]
U21  SN74LV4066APWR  [SN74LV4066A_TSSOP-14]
U22  SN74LV4066APWR  [SN74LV4066A_TSSOP-14]
U23  SN74LV4066APWR  [SN74LV4066A_TSSOP-14]
U24  SSM6J507NU,LF  P-CHANNEL_FET_SSM6J507NU,LF  [SSM6J507NU]
U25  SSM6J507NU,LF  P-CHANNEL_FET_SSM6J507NU,LF  [SSM6J507NU]
U26  SSM6J507NU,LF  P-CHANNEL_FET_SSM6J507NU,LF  [SSM6J507NU]
U27  SSM6J507NU,LF  P-CHANNEL_FET_SSM6J507NU,LF  [SSM6J507NU]
U$59  MF_LOGOLOGO_TEXT  [MF_LOGO_TEXT]
UNIT1  OPENMV3  [OPENMV3]
UNIT2  OPENMV3  [OPENMV3]
UNIT3  OPENMV3  [OPENMV3]
UNIT4  OPENMV3  [OPENMV3]
UNIT5  OPENMV3  [OPENMV3]
UNIT6  OPENMV3  [OPENMV3]
UNIT7  OPENMV3  [OPENMV3]
UNIT8  OPENMV3  [OPENMV3]
UNIT9  OPENMV3  [OPENMV3]
UNIT10  OPENMV3  [OPENMV3]
UNIT11  OPENMV3  [OPENMV3]
UNIT12  OPENMV3  [OPENMV3]
UNIT13  OPENMV3  [OPENMV3]
UNIT14  OPENMV3  [OPENMV3]
UNIT15  OPENMV3  [OPENMV3]
UNIT16  OPENMV3  [OPENMV3]
UNIT17  OPENMV3  [OPENMV3]
UNIT18  OPENMV3  [OPENMV3]
UNIT19  OPENMV3  [OPENMV3]
UNIT20  OPENMV3  [OPENMV3]
X1  ABMM-6.000MHZ-B2-T  CYRSTAL_GND_ABMM  [7MMX5MM]

## Nets
3.3V: C1.P$1 C2.P$1 C3.P$1 C4.P$1 C5.P$1 C6.P$1 C7.P$1 C13.P$1 C14.P$1 C16.P$2 C17.P$2 C18.P$2 C19.P$2 C20.P$2 C21.P$2 C22.P$2 C23.P$2 C24.P$2 C25.P$2 C26.P$2 C27.P$2 C28.P$2 C29.P$2 C30.P$2 C31.P$2 C32.P$2 C33.P$2 C34.P$2 C35.P$2 C36.P$1 C37.P$1 C38.P$1 C39.P$1 C61.P$1 C62.P$1 D1.ANODE D2.ANODE D3.ANODE D4.CATH(CATHODE) J2.PIN R1.P$1 R2.P$1 R3.P$1 R4.P$1 R5.P$1 R6.P$1 R7.P$1 R8.P$1 R9.P$1 R30.P$1 R31.P$1 R32.P$1 R33.P$1 SD1.PIN4(3.3V) U1.8(VDD) U1.18(VDD) U1.30(VDD) U1.40(VDD) U2.8(VCC) U3.1(VCCIO) U3.9(RESET#) U3.10(VCC) U4.P$14(_A:VCC) U5.P$14(_A:VCC) U6.P$14(_A:VCC) U7.P$14(_A:VCC) U8.P$14(_A:VCC) U9.P$14(_A:VCC) U10.P$14(_A:VCC) U11.P$14(_A:VCC) U12.P$14(_A:VCC) U13.P$14(_A:VCC) U14.P$14(_A:VCC) U15.P$14(_A:VCC) U16.P$14(_A:VCC) U17.P$14(_A:VCC) U18.P$14(_A:VCC) U19.P$14(_A:VCC) U20.P$14(_A:VCC) U21.P$14(_A:VCC) U22.P$14(_A:VCC) U23.P$14(_A:VCC) U24.P$1(DRAIN) U24.P$2(DRAIN) U24.P$5(DRAIN) U24.P$6(DRAIN) U24.P$8(DRAIN) U25.P$1(DRAIN) U25.P$2(DRAIN) U25.P$5(DRAIN) U25.P$6(DRAIN) U25.P$8(DRAIN) U26.P$1(DRAIN) U26.P$2(DRAIN) U26.P$5(DRAIN) U26.P$6(DRAIN) U26.P$8(DRAIN) U27.P$1(DRAIN) U27.P$2(DRAIN) U27.P$5(DRAIN) U27.P$6(DRAIN) U27.P$8(DRAIN)
3.3V_R1: 3.3V_1,1.P$1 3.3V_2,1.P$1 3.3V_3,1.P$1 3.3V_4,1.P$1 3.3V_5,1.P$1 U24.P$4(SOURCE) U24.P$7(SOURCE)
3.3V_R2: 3.3V_1,2.P$1 3.3V_2,2.P$1 3.3V_3,2.P$1 3.3V_4,2.P$1 3.3V_5,2.P$1 U25.P$4(SOURCE) U25.P$7(SOURCE)
3.3V_R3: 3.3V_1,3.P$1 3.3V_2,3.P$1 3.3V_3,3.P$1 3.3V_4,3.P$1 3.3V_5,3.P$1 U26.P$4(SOURCE) U26.P$7(SOURCE)
3.3V_R4: 3.3V_1,4.P$1 3.3V_2,4.P$1 3.3V_3,4.P$1 3.3V_4,4.P$1 3.3V_5,4.P$1 U27.P$4(SOURCE) U27.P$7(SOURCE)
3V3OUT: C12.P$1 U3.8(3V3OUT)
!RTS: C15.P$1 U3.16(RTS#)
CC1: J1.A5(CC1) R10.P$1
CTRL_ROW_1: U1.44(P3) U4.P$5(_B:CNTRL) U4.P$6(_C:CNTRL) U4.P$13(_A:CNTRL) U8.P$5(_B:CNTRL) U8.P$6(_C:CNTRL) U8.P$13(_A:CNTRL) U12.P$5(_B:CNTRL) U12.P$6(_C:CNTRL) U12.P$13(_A:CNTRL) U16.P$5(_B:CNTRL) U16.P$6(_C:CNTRL) U16.P$13(_A:CNTRL) U20.P$5(_B:CNTRL) U20.P$6(_C:CNTRL) U20.P$13(_A:CNTRL)
CTRL_ROW_2: U1.43(P2) U5.P$5(_B:CNTRL) U5.P$6(_C:CNTRL) U5.P$13(_A:CNTRL) U9.P$5(_B:CNTRL) U9.P$6(_C:CNTRL) U9.P$13(_A:CNTRL) U13.P$5(_B:CNTRL) U13.P$6(_C:CNTRL) U13.P$13(_A:CNTRL) U17.P$5(_B:CNTRL) U17.P$6(_C:CNTRL) U17.P$13(_A:CNTRL) U21.P$5(_B:CNTRL) U21.P$6(_C:CNTRL) U21.P$13(_A:CNTRL)
CTRL_ROW_3: U1.42(P1) U6.P$5(_B:CNTRL) U6.P$6(_C:CNTRL) U6.P$13(_A:CNTRL) U10.P$5(_B:CNTRL) U10.P$6(_C:CNTRL) U10.P$13(_A:CNTRL) U14.P$5(_B:CNTRL) U14.P$6(_C:CNTRL) U14.P$13(_A:CNTRL) U18.P$5(_B:CNTRL) U18.P$6(_C:CNTRL) U18.P$13(_A:CNTRL) U22.P$5(_B:CNTRL) U22.P$6(_C:CNTRL) U22.P$13(_A:CNTRL)
CTRL_ROW_4: U1.41(P0) U7.P$5(_B:CNTRL) U7.P$6(_C:CNTRL) U7.P$13(_A:CNTRL) U11.P$5(_B:CNTRL) U11.P$6(_C:CNTRL) U11.P$13(_A:CNTRL) U15.P$5(_B:CNTRL) U15.P$6(_C:CNTRL) U15.P$13(_A:CNTRL) U19.P$5(_B:CNTRL) U19.P$6(_C:CNTRL) U19.P$13(_A:CNTRL) U23.P$5(_B:CNTRL) U23.P$6(_C:CNTRL) U23.P$13(_A:CNTRL)
D+: C8.P$1 J1.A6(D+) J1.B6(D+) R11.P$1
D-: C9.P$1 J1.A7(D-) J1.B7(D-) R12.P$1
GND: C1.P$2 C2.P$2 C3.P$2 C4.P$2 C5.P$2 C6.P$2 C7.P$2 C8.P$2 C9.P$2 C10.P$2 C11.P$2 C12.P$2 C13.P$2 C14.P$2 C16.P$1 C17.P$1 C18.P$1 C19.P$1 C20.P$1 C21.P$1 C22.P$1 C23.P$1 C24.P$1 C25.P$1 C26.P$1 C27.P$1 C28.P$1 C29.P$1 C30.P$1 C31.P$1 C32.P$1 C33.P$1 C34.P$1 C35.P$1 C36.P$2 C37.P$2 C38.P$2 C39.P$2 C61.P$2 C62.P$2 D4.ANODE GND_1,1.P$1 GND_1,2.P$1 GND_1,3.P$1 GND_1,4.P$1 GND_2,1.P$1 GND_2,2.P$1 GND_2,3.P$1 GND_2,4.P$1 GND_3,1.P$1 GND_3,2.P$1 GND_3,3.P$1 GND_3,4.P$1 GND_4,1.P$1 GND_4,2.P$1 GND_4,3.P$1 GND_4,4.P$1 GND_5,1.P$1 GND_5,2.P$1 GND_5,3.P$1 GND_5,4.P$1 J1.A1(GND) J1.A12(GND) J1.B1(GND) J1.B12(GND) J2.SLEEVE1(SLEEVE) J2.SLEEVE2(SLEEVE_SHUNT) L2.P$2 R10.P$2 R14.P$1 R35.P$2 SD1.G0(GND) SD1.G1(GND) SD1.PIN6(GND) SW1.P$3 U1.5(VSS) U1.6(BOE') U1.17(VSS) U1.27(VSS) U1.39(VSS) U2.1(A0) U2.2(A1) U2.3(A2) U2.4(GND) U2.7(WP) U3.3(GND) U3.13(GND) U3.PAD(GND) U4.P$7(_A:GND) U5.P$7(_A:GND) U6.P$7(_A:GND) U7.P$7(_A:GND) U8.P$7(_A:GND) U9.P$7(_A:GND) U10.P$7(_A:GND) U11.P$7(_A:GND) U12.P$7(_A:GND) U13.P$7(_A:GND) U14.P$7(_A:GND) U15.P$7(_A:GND) U16.P$7(_A:GND) U17.P$7(_A:GND) U18.P$7(_A:GND) U19.P$7(_A:GND) U20.P$7(_A:GND) U21.P$7(_A:GND) U22.P$7(_A:GND) U23.P$7(_A:GND) X1.P$2(GND) X1.P$4(GND)
I2C_SCL: R9.P$2 U1.35(P28) U2.6(SCL)
I2C_SDA: R8.P$2 U1.36(P29) U2.5(SDA)
IRQ: R2.P$2 SD1.PIN8(IRQ)
LED_HB: R36.P$2 U1.26(P23)
N$1: R16.P$1 U4.P$4(_B:A) U5.P$4(_B:A) U6.P$4(_B:A) U7.P$4(_B:A)
N$2: R18.P$1 U8.P$1(_A:A) U9.P$1(_A:A) U10.P$1(_A:A) U11.P$1(_A:A)
N$3: R15.P$1 U4.P$1(_A:A) U5.P$1(_A:A) U6.P$1(_A:A) U7.P$1(_A:A)
N$4: R20.P$1 U8.P$8(_C:A) U9.P$8(_C:A) U10.P$8(_C:A) U11.P$8(_C:A)
N$5: R19.P$1 U8.P$4(_B:A) U9.P$4(_B:A) U10.P$4(_B:A) U11.P$4(_B:A)
N$6: R21.P$1 U12.P$1(_A:A) U13.P$1(_A:A) U14.P$1(_A:A) U15.P$1(_A:A)
N$7: R23.P$1 U12.P$8(_C:A) U13.P$8(_C:A) U14.P$8(_C:A) U15.P$8(_C:A)
N$8: R17.P$1 U4.P$8(_C:A) U5.P$8(_C:A) U6.P$8(_C:A) U7.P$8(_C:A)
N$9: R22.P$1 U12.P$4(_B:A) U13.P$4(_B:A) U14.P$4(_B:A) U15.P$4(_B:A)
N$10: R24.P$1 U16.P$1(_A:A) U17.P$1(_A:A) U18.P$1(_A:A) U19.P$1(_A:A)
N$11: R26.P$1 U16.P$8(_C:A) U17.P$8(_C:A) U18.P$8(_C:A) U19.P$8(_C:A)
N$12: R25.P$1 U16.P$4(_B:A) U17.P$4(_B:A) U18.P$4(_B:A) U19.P$4(_B:A)
N$13: R27.P$1 U20.P$1(_A:A) U21.P$1(_A:A) U22.P$1(_A:A) U23.P$1(_A:A)
N$14: R29.P$1 U20.P$8(_C:A) U21.P$8(_C:A) U22.P$8(_C:A) U23.P$8(_C:A)
N$15: R28.P$1 U20.P$4(_B:A) U21.P$4(_B:A) U22.P$4(_B:A) U23.P$4(_B:A)
N$16: D3.CATHODE R36.P$1
N$17: D2.CATHODE R35.P$1
N$18: C15.P$2 SW2.P$1
N$19: D1.CATHODE R34.P$1
PWR_1: R30.P$2 U1.22(P19) U24.P$3(GATE)
PWR_2: R31.P$2 U1.23(P20) U25.P$3(GATE)
PWR_3: R32.P$2 U1.24(P21) U26.P$3(GATE)
PWR_4: R33.P$2 U1.25(P22) U27.P$3(GATE)
RES: R1.P$2 SW1.P$2 SW2.P$4 U1.7(RES')
RW: R7.P$2 SD1.PIN1(RW)
RX: U1.37(P30) U3.2(RXD)
SD_CLK: R4.P$2 SD1.PIN5(SCLK) U1.32(P25)
SD_CS: R6.P$2 SD1.PIN2(CS) U1.34(P27)
SD_DI: R5.P$2 SD1.PIN3(DI) U1.33(P26)
SD_DO: R3.P$2 SD1.PIN7(D0) U1.31(P24)
SHLD: J1.S_T1(SHLD) J1.S_T2(SHLD) J1.S_T3(SHLD) J1.S_T4(SHLD) L2.P$1
SWD_CLK_1: R15.P$2 U1.1(P4)
SWD_CLK_1,1: SWD_CLK_1,1.P$1 U4.P$2(_A:B)
SWD_CLK_1,2: SWD_CLK_1,2.P$1 U5.P$2(_A:B)
SWD_CLK_1,3: SWD_CLK_1,3.P$1 U6.P$2(_A:B)
SWD_CLK_1,4: SWD_CLK_1,4.P$1 U7.P$2(_A:B)
SWD_CLK_2: R18.P$2 U1.4(P7)
SWD_CLK_2,1: SWD_CLK_2,1.P$1 U8.P$2(_A:B)
SWD_CLK_2,2: SWD_CLK_2,2.P$1 U9.P$2(_A:B)
SWD_CLK_2,3: SWD_CLK_2,3.P$1 U10.P$2(_A:B)
SWD_CLK_2,4: SWD_CLK_2,4.P$1 U11.P$2(_A:B)
SWD_CLK_3: R21.P$2 U1.11(P10)
SWD_CLK_3,1: SWD_CLK_3,1.P$1 U12.P$2(_A:B)
SWD_CLK_3,2: SWD_CLK_3,2.P$1 U13.P$2(_A:B)
SWD_CLK_3,3: SWD_CLK_3,3.P$1 U14.P$2(_A:B)
SWD_CLK_3,4: SWD_CLK_3,4.P$1 U15.P$2(_A:B)
SWD_CLK_4: R24.P$2 U1.14(P13)
SWD_CLK_4,1: SWD_CLK_4,1.P$1 U16.P$2(_A:B)
SWD_CLK_4,2: SWD_CLK_4,2.P$1 U17.P$2(_A:B)
SWD_CLK_4,3: SWD_CLK_4,3.P$1 U18.P$2(_A:B)
SWD_CLK_4,4: SWD_CLK_4,4.P$1 U19.P$2(_A:B)
SWD_CLK_5: R27.P$2 U1.19(P16)
SWD_CLK_5,1: SWD_CLK_5,1.P$1 U20.P$2(_A:B)
SWD_CLK_5,2: SWD_CLK_5,2.P$1 U21.P$2(_A:B)
SWD_CLK_5,3: SWD_CLK_5,3.P$1 U22.P$2(_A:B)
SWD_CLK_5,4: SWD_CLK_5,4.P$1 U23.P$2(_A:B)
SWD_DAT_1: R16.P$2 U1.2(P5)
SWD_DAT_1,1: SWD_DAT_1,1.P$1 U4.P$3(_B:B)
SWD_DAT_1,2: SWD_DAT_1,2.P$1 U5.P$3(_B:B)
SWD_DAT_1,3: SWD_DAT_1,3.P$1 U6.P$3(_B:B)
SWD_DAT_1,4: SWD_DAT_1,4.P$1 U7.P$3(_B:B)
SWD_DAT_2: R19.P$2 U1.9(P8)
SWD_DAT_2,1: SWD_DAT_2,1.P$1 U8.P$3(_B:B)
SWD_DAT_2,2: SWD_DAT_2,2.P$1 U9.P$3(_B:B)
SWD_DAT_2,3: SWD_DAT_2,3.P$1 U10.P$3(_B:B)
SWD_DAT_2,4: SWD_DAT_2,4.P$1 U11.P$3(_B:B)
SWD_DAT_3: R22.P$2 U1.12(P11)
SWD_DAT_3,1: SWD_DAT_3,1.P$1 U12.P$3(_B:B)
SWD_DAT_3,2: SWD_DAT_3,2.P$1 U13.P$3(_B:B)
SWD_DAT_3,3: SWD_DAT_3,3.P$1 U14.P$3(_B:B)
SWD_DAT_3,4: SWD_DAT_3,4.P$1 U15.P$3(_B:B)
SWD_DAT_4: R25.P$2 U1.15(P14)
SWD_DAT_4,1: SWD_DAT_4,1.P$1 U16.P$3(_B:B)
SWD_DAT_4,2: SWD_DAT_4,2.P$1 U17.P$3(_B:B)
SWD_DAT_4,3: SWD_DAT_4,3.P$1 U18.P$3(_B:B)
SWD_DAT_4,4: SWD_DAT_4,4.P$1 U19.P$3(_B:B)
SWD_DAT_5: R28.P$2 U1.20(P17)
SWD_DAT_5,1: SWD_DAT_5,1.P$1 U20.P$3(_B:B)
SWD_DAT_5,2: SWD_DAT_5,2.P$1 U21.P$3(_B:B)
SWD_DAT_5,3: SWD_DAT_5,3.P$1 U22.P$3(_B:B)
SWD_DAT_5,4: SWD_DAT_5,4.P$1 U23.P$3(_B:B)
SWD_RST_1: R17.P$2 U1.3(P6)
SWD_RST_1,1: SWD_RST_1,1.P$1 U4.P$9(_C:B)
SWD_RST_1,2: SWD_RST_1,2.P$1 U5.P$9(_C:B)
SWD_RST_1,3: SWD_RST_1,3.P$1 U6.P$9(_C:B)
SWD_RST_1,4: SWD_RST_1,4.P$1 U7.P$9(_C:B)
SWD_RST_2: R20.P$2 U1.10(P9)
SWD_RST_2,1: SWD_RST_2,1.P$1 U8.P$9(_C:B)
SWD_RST_2,2: SWD_RST_2,2.P$1 U9.P$9(_C:B)
SWD_RST_2,3: SWD_RST_2,3.P$1 U10.P$9(_C:B)
SWD_RST_2,4: SWD_RST_2,4.P$1 U11.P$9(_C:B)
SWD_RST_3: R23.P$2 U1.13(P12)
SWD_RST_3,1: SWD_RST_3,1.P$1 U12.P$9(_C:B)
SWD_RST_3,2: SWD_RST_3,2.P$1 U13.P$9(_C:B)
SWD_RST_3,3: SWD_RST_3,3.P$1 U14.P$9(_C:B)
SWD_RST_3,4: SWD_RST_3,4.P$1 U15.P$9(_C:B)
SWD_RST_4: R26.P$2 U1.16(P15)
SWD_RST_4,1: SWD_RST_4,1.P$1 U16.P$9(_C:B)
SWD_RST_4,2: SWD_RST_4,2.P$1 U17.P$9(_C:B)
SWD_RST_4,3: SWD_RST_4,3.P$1 U18.P$9(_C:B)
SWD_RST_4,4: SWD_RST_4,4.P$1 U19.P$9(_C:B)
SWD_RST_5: R29.P$2 U1.21(P18)
SWD_RST_5,1: SWD_RST_5,1.P$1 U20.P$9(_C:B)
SWD_RST_5,2: SWD_RST_5,2.P$1 U21.P$9(_C:B)
SWD_RST_5,3: SWD_RST_5,3.P$1 U22.P$9(_C:B)
SWD_RST_5,4: SWD_RST_5,4.P$1 U23.P$9(_C:B)
TX: U1.38(P31) U3.15(TXD)
TXRX_LED: R34.P$2 U3.5(CBUS2)
USBDM: R12.P$2 U3.7(USBDM)
USBDP: R11.P$2 U3.6(USBDP)
V_USB: J1.A4(VBUS) J1.A9(VBUS) J1.B4(VBUS) J1.B9(VBUS) L1.P$1
V_USB_SENSE: C10.P$1 C11.P$1 L1.P$2 R13.P$2
VBUS_SENSE: R13.P$1 R14.P$2 U3.12(CBUS0)
X0: U1.29(X0) X1.P$3(X1)
X1: U1.28(X1) X1.P$1(X0)
Unconnected: J1.A2(TX1+) J1.A3(TX1-) J1.A8(SBU1) J1.A10(RX2-) J1.A11(RX2+) J1.B2(TX2+) J1.B3(TX2-) J1.B5(CC2) J1.B8(SBU2) J1.B10(RX1-) J1.B11(RX1+) SD1.PIN9(CRD_DTCT) SD1.PIN10(CRD_DTCT) SW1.P$1 SW1.P$4 SW2.P$2 SW2.P$3 U3.4(CTS#) U3.11(CBUS1) U3.14(CBUS3) U4.P$10(_D:B) U4.P$11(_D:A) U4.P$12(_D:CNTRL) U5.P$10(_D:B) U5.P$11(_D:A) U5.P$12(_D:CNTRL) U6.P$10(_D:B) U6.P$11(_D:A) U6.P$12(_D:CNTRL) U7.P$10(_D:B) U7.P$11(_D:A) U7.P$12(_D:CNTRL) U8.P$10(_D:B) U8.P$11(_D:A) U8.P$12(_D:CNTRL) U9.P$10(_D:B) U9.P$11(_D:A) U9.P$12(_D:CNTRL) U10.P$10(_D:B) U10.P$11(_D:A) U10.P$12(_D:CNTRL) U11.P$10(_D:B) U11.P$11(_D:A) U11.P$12(_D:CNTRL) U12.P$10(_D:B) U12.P$11(_D:A) U12.P$12(_D:CNTRL) U13.P$10(_D:B) U13.P$11(_D:A) U13.P$12(_D:CNTRL) U14.P$10(_D:B) U14.P$11(_D:A) U14.P$12(_D:CNTRL) U15.P$10(_D:B) U15.P$11(_D:A) U15.P$12(_D:CNTRL) U16.P$10(_D:B) U16.P$11(_D:A) U16.P$12(_D:CNTRL) U17.P$10(_D:B) U17.P$11(_D:A) U17.P$12(_D:CNTRL) U18.P$10(_D:B) U18.P$11(_D:A) U18.P$12(_D:CNTRL) U19.P$10(_D:B) U19.P$11(_D:A) U19.P$12(_D:CNTRL) U20.P$10(_D:B) U20.P$11(_D:A) U20.P$12(_D:CNTRL) U21.P$10(_D:B) U21.P$11(_D:A) U21.P$12(_D:CNTRL) U22.P$10(_D:B) U22.P$11(_D:A) U22.P$12(_D:CNTRL) U23.P$10(_D:B) U23.P$11(_D:A) U23.P$12(_D:CNTRL)

## Library data of the parts
3.3V_1,1-3.3V_1,4 3.3V_2,1-3.3V_2,4 3.3V_3,1-3.3V_3,4 3.3V_4,1-3.3V_4,4 3.3V_5,1-3.3V_5,4 GND_1,1-GND_1,4 GND_2,1-GND_2,4 GND_3,1-GND_3,4 GND_4,1-GND_4,4 GND_5,1-GND_5,4 SWD_CLK_1,1-SWD_CLK_1,4 SWD_CLK_2,1-SWD_CLK_2,4 SWD_CLK_3,1-SWD_CLK_3,4 SWD_CLK_4,1-SWD_CLK_4,4 SWD_CLK_5,1-SWD_CLK_5,4 SWD_DAT_1,1-SWD_DAT_1,4 SWD_DAT_2,1-SWD_DAT_2,4 SWD_DAT_3,1-SWD_DAT_3,4 SWD_DAT_4,1-SWD_DAT_4,4 SWD_DAT_5,1-SWD_DAT_5,4 SWD_RST_1,1-SWD_RST_1,4 SWD_RST_2,1-SWD_RST_2,4 SWD_RST_3,1-SWD_RST_3,4 SWD_RST_4,1-SWD_RST_4,4 SWD_RST_5,1-SWD_RST_5,4 = PP_Connectors:POGO_PIN; POPULATE: 1
C1-C35 C61 C62 = MF_Passives:CAPACITOR_NP: Library: MF_Passives Description: Device for Non-Polarized Capacitors. Manufacture part number (MPN) can be added via Attributes. Check https://factory.macrofab.com/parts for the house parts list.; POPULATE: 1
C36-C39 = MF_Passives:CAPACITOR_P: Library: MF_Passives Description: Device for Polarized Capacitors. Manufacture part number (MPN), Voltage Rating, and Tolerance can be added via Attributes. Check https://factory.macrofab.com/parts for the house parts list.; POPULATE: 1
D1-D3 = MF_LEDs:LED_SINGLE: Library: MF_LEDs Description: Device for Single LED Packages. Manufacture part number (MFG#) can be added via Attributes.; HOUSEPART: YES; MPN: MF-LED-0805-RED; POPULATE: 1; URL: https://factory.macrofab.com/part/MF-LED-0805-RED
D4 = PP_Passives:DIODE: Diode - Single
FRAME1 = MF_Aesthetics:MF_FRAME: Library: MF_Aesthetics Description: Frame for adding Meta Data to the PCB and Schematic.; DNAME: Parker Dillmann; HOUSEPART: 0; POPULATE: 0; REVNUM: REV: 1
J1 = PP_Connectors:USB_TYPE-C; POPULATE: 1
J2 = MF_Connectors:DC_PWR_JACK: Library: MF_Connectors Description: DC Barrel Power Jack Connector.; HOUSEPART: NO; MPN: KLDX-0202-A; POPULATE: 1; URL: http://www.4uconnector.com/online/object/4udrawing/18741.pdf
L1 L2 = MF_Passives:INDUCTOR: Library: MF_Passives Description: Device for Inductors. Manufacture part number (MPN) can be added via Attributes. Check https://factory.macrofab.com/parts for the house parts list.; POPULATE: 1
R1-R36 = MF_Passives:RESISTOR: Library: MF_Passives Description: Device for Resistors. Manufacture part number (MPN), Voltage, Tolerance, and Wattage Rating can be added via Attributes. Check https://factory.macrofab.com/parts for the house parts list.; POPULATE: 1
SD1 = MF_Connectors:SD_CARD_SLOT: Library: MF_Connectors Description: SD Card Connector; HOUSEPART: YES; MPN: MF-MICROSD; POPULATE: 1; URL: https://factory.macrofab.com/part/MF-MICROSD
SW1 SW2 = MF_Switches:TACT: Library: MF_Switches Description: Device for Tact Switches. Manufacture part number (MFG#) can be added via Attributes.; HOUSEPART: YES; MPN: MF-SW-TACT-6MM; POPULATE: 1; URL: https://factory.macrofab.com/part/MF-SW-TACT-6MM
U1 = MF_IC_Digital:P8X32A: Manufacturer Part #: P8X32A Manufacturer: Parallax Description: 32-bit Microcontrollers - MCU LQFP pkg Propeller Chip; HOUSEPART: NO; MPN: P8X32A-Q44; POPULATE: 1; URL: https://www.parallax.com/sites/default/files/downloads/P8X32A-Propeller-Datasheet-v1.4.0_0.pdf
U2 = PP_DigitalIC:EEPROM_I2C
U3 = PP_DigitalIC:FT230X: Manufacturer Part #: FT230X Manufacturer: FTDI Description: USB Interface IC USB to Basic Serial UART IC
U4-U23 = Jig_Parts:SN74LV4066A
U24-U27 = Jig_Parts:P-CHANNEL_FET
U$59 = PP_Aesthetics:MF_LOGO
UNIT1-UNIT20 = Jig_Parts:OPENMV3
X1 = MF_Frequency_Control:CYRSTAL_GND: Library: MF_Frequency_Control Description: Device for two functional pin Cyrstal Oscillators and a ground.; HOUSEPART: NO; POPULATE: 1; URL: http://www.abracon.com/Resonators/ABMM.pdf